# Altium schematic sheet NRF51822 schematic.SchDoc
size A; SheetNumber: 1; SheetTotal: 1; SPICEModelCacheBJAEYDSY: <root> / <DocumentId>BJAEYDSY</DocumentId> / <CacheFrame Number="0"> / <Model Name="cap" Kind="MDL"> / <Text>*Default semiconductor capacitor / .MODEL CAP C()</Text> / </Model> / <Model Name="led3" Kind="MDL"> / <Text>*Typ BLUE SiC LED: Vf=3.4V Vr=5V If=40mA trr=3uS / *LED Pinout: 1=A, 2=K / .MODEL LED3 D (IS=93.1P RS=42M N=7.47 BV=5 IBV=30U / + CJO=2.97P VJ=.75 M=.333 TT=4.32U)</Text> / </Model> / </CacheFrame> / </root>
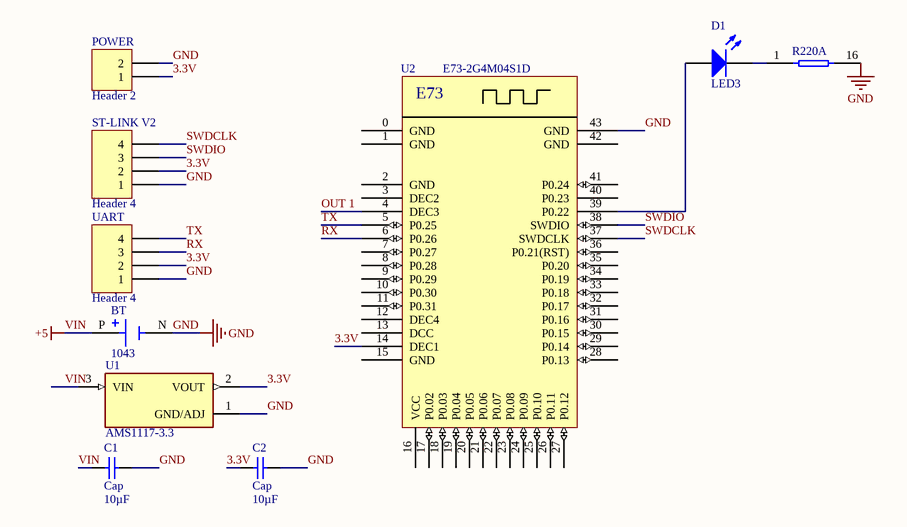
[diagram p0: NRF51822 schematic.SchDoc]

## Parts
BT  1043  [BAT_1043]
C1  Cap  value 10µF  [RAD-0.3]
C2  Cap  value 10µF  [RAD-0.3]
D1  LED3  [3.5X2.8X1.9]
POWER  Header 2  [HDR1X2]
R220  Res Pack2  [DIP-16]  (value not drawn)  (part A of 8)
ST-LINK_V2  Header 4  [HDR1X4]
U1  AMS1117-3.3  [SOT229P700X180-4N]
U2  E73-2G4M04S1D  [E73-2G4M04S1D]
UART  Header 4  [HDR1X4]

## Nets
GND: BT.N(NEG) C1.2 C2.2 POWER.2 R220.16 ST-LINK_V2.1 U1.1(GND/ADJ) U2.43(GND) UART.1
VIN: BT.P(POS) C1.1 U1.3(VIN)  [also labelled +5]
3.3V: C2.1 POWER.1 ST-LINK_V2.2 U1.2(VOUT) U2.14(DEC1) UART.2
OUT 1: U2.4(DEC3)
RX: U2.6(P0.26) UART.3
SWDCLK: ST-LINK_V2.4 U2.37(SWDCLK)
SWDIO: ST-LINK_V2.3 U2.38(SWDIO)
TX: U2.5(P0.25) UART.4
NetD1_1: D1.1(A) U2.39(P0.22)
NetD1_2: D1.2(K) R220.1

Not connected (* = marked no-connect by the designer): U2 0(GND) 1(GND) 2(GND) 3(DEC2) 7(P0.27) 8(P0.28) 9(P0.29) 10(P0.30) 11(P0.31) 12(DEC4) 13(DCC) 15(GND) 16(VCC) 17(P0.02) 18(P0.03) 19(P0.04) 20(P0.05) 21(P0.06) 22(P0.07) 23(P0.08) 24(P0.09) 25(P0.10) 26(P0.11) 27(P0.12) 28(P0.13) 29(P0.14) 30(P0.15) 31(P0.16) 32(P0.17) 33(P0.18) 34(P0.19) 35(P0.20) 36(P0.21(RST)) 40(P0.23) 41(P0.24) 42(GND)

## Notes on the sheet
- (in symbol E73-2G4M04S1D) E73

## Library data of the parts
BT = 1043: THM Holder for 18650 Battery; MF: Keystone Electronics; SnapEDA_Link: https://www.snapeda.com/parts/1043/Keystone/view-part/?ref=snap; Package: NON STANDARD-5 Keystone; Value: *; MP: 1043; Check_prices: https://www.snapeda.com/parts/1043/Keystone/view-part/?ref=eda
C1 C2 = Cap: Capacitor; Published: 8-Jun-2000; LatestRevisionDate: 17-Jul-2002; LatestRevisionNote: Re-released for DXP Platform.; PackageReference: RAD-0.3; Publisher: Altium Limited; PackageDescription: Radial Cap, Thru-Hole; 2 Leads; 0.3 in Pin Spacing
D1 = LED3: Typical BLUE SiC LED; Published: 8-Jun-2000; LatestRevisionDate: 17-Dec-2003; LatestRevisionNote: PCB Footprint replaced.; DatasheetVersion: 16-Apr-2002; PackageVersion: 16-Apr-2002; PackageReference: 3.5X2.8X1.9; Publisher: Altium Limited; PackageDescription: SM LED; 2 C-Bend Leads; Body 3.5 x 2.8 x 1.9 mm, inc leads (LxWxH typ)
POWER = Header 2: Header, 2-Pin; LatestRevisionDate: 17-Jul-2002; LatestRevisionNote: Re-released for DXP Platform.; Publisher: Altium Limited
R220 = Res Pack2: Isolated Resistor Network - Parts; Sim Note: Enter the Resistance value into parameter field.; Value: 1K; Published: 24-Mar-1999; LatestRevisionDate: 17-Jul-2002; LatestRevisionNote: Re-released for DXP Platform.; PackageReference: DIP-16; Publisher: Altium Limited; Code_JEDEC: MO-001-AC
ST-LINK_V2 UART = Header 4: Header, 4-Pin; LatestRevisionDate: 17-Jul-2002; LatestRevisionNote: Re-released for DXP Platform.; Publisher: Altium Limited
U1 = AMS1117-3.3: Sot223/Pkg 1-Amp 3.3-Volt Low Drop Out Voltage Regulatator; MF: Advanced Monolithic Systems; SnapEDA_Link: https://www.snapeda.com/parts/AMS1117-3.3/Advanced+Monolithic+Systems/view-part/?ref=snap; Package: SOT-223 Seeed Technology; Value: *; MP: AMS1117-3.3; Check_prices: https://www.snapeda.com/parts/AMS1117-3.3/Advanced+Monolithic+Systems/view-part/?ref=eda
U2 = E73-2G4M04S1D: E73-2G4M04S1D is a small Bluetooth module that features ultra low power consumption with dual antenna PCB and IPX antenna of high performance. Based on originally imported IC nRF51822 from NORDIC,the module supports BLE 4.2 protocol.